# EAGLE design ioShield-A (EAGLE 6.4)
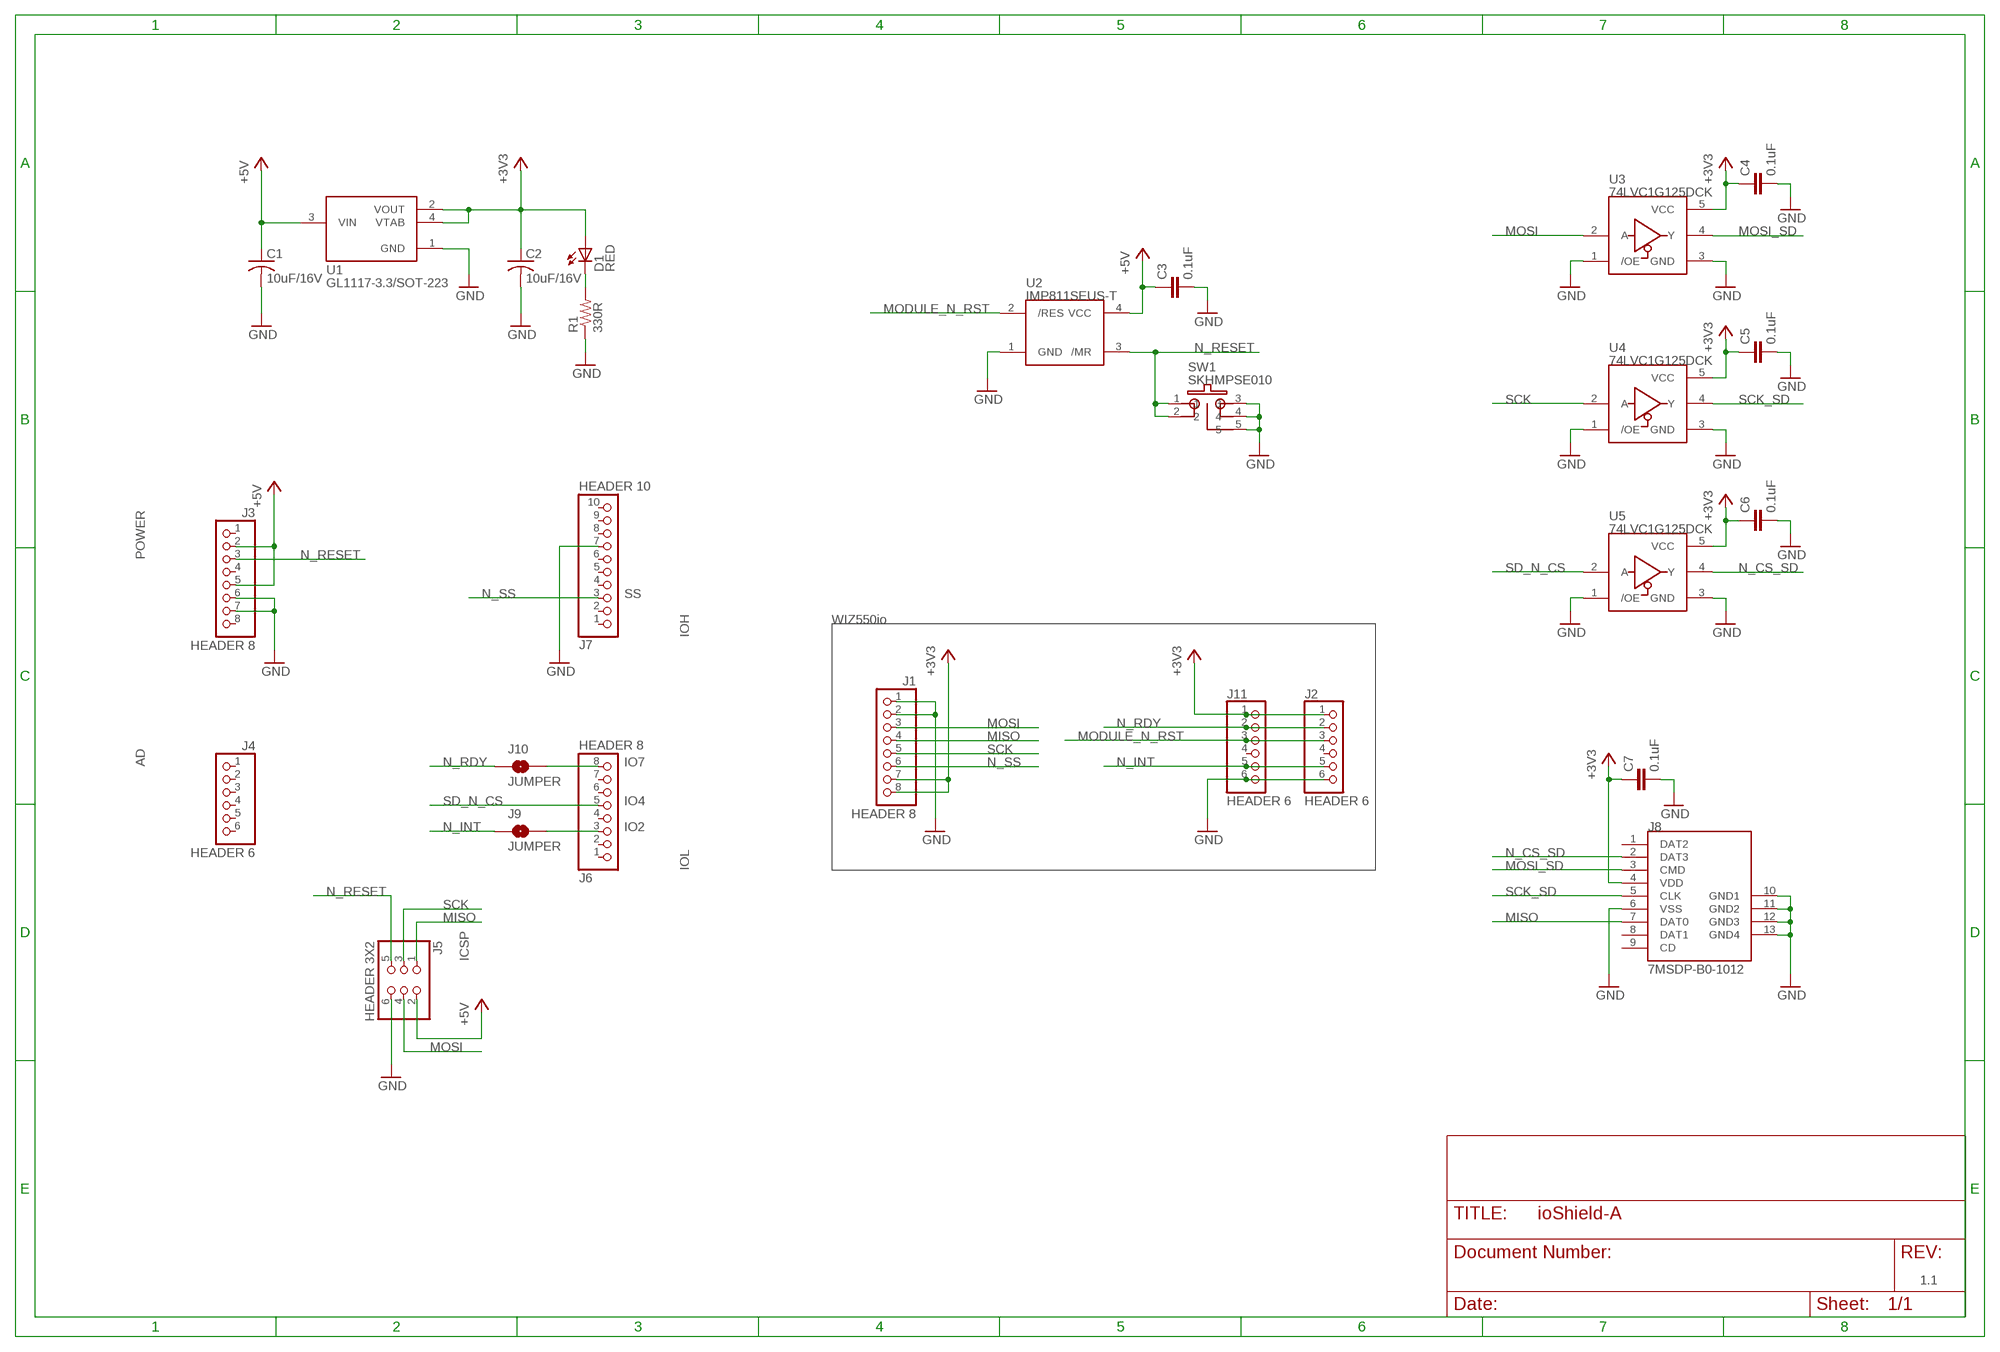
[diagram p0: schematic, sheet 1]

## Parts
C1  10uF/16V  CT-A(3216)  [CT-A(3216)]
C2  10uF/16V  CT-A(3216)  [CT-A(3216)]
C3  0.1uF  C1608  [C1608]
C4  0.1uF  C1608  [C1608]
C5  0.1uF  C1608  [C1608]
C6  0.1uF  C1608  [C1608]
C7  0.1uF  C1608  [C1608]
D1  RED  LED1608  [CHIP-LED1608]
J1  HEADER 8  HEADER8  [HEADER1X8]
J2  HEADER 6  HEADER6  [HEADER1X6]
J3  HEADER 8  HEADER8  [HEADER1X8]
J4  HEADER 6  HEADER6  [HEADER1X6]
J5  HEADER 3X2  HEADER3X2  [HEADER3X2]
J6  HEADER 8  HEADER8  [HEADER1X8]
J7  HEADER 10  HEADER10  [HEADER1X10]
J8  7MSDP-B0-1012  [MICROSD_HC]
J9  JUMPER  SJ  [SJ]
J10  JUMPER  SJ  [SJ]
J11  HEADER 6  HEADER6  [HEADER1X6]
R1  330R  R1608  [R1608]
SW1  SKHMPSE010  TACT_6.2X6.5  [TACT_6.2X6.5]
U1  GL1117-3.3/SOT-223  [SOT223_HC]
U2  IMP811SEUS-T  [SOT-143]
U3  74LVC1G125DCK  SN74LVC1G125  [SC70-5(DCK)]
U4  74LVC1G125DCK  SN74LVC1G125  [SC70-5(DCK)]
U5  74LVC1G125DCK  SN74LVC1G125  [SC70-5(DCK)]

## Nets
+3V3: C2.+ C4.1 C5.1 C6.1 C7.1 D1.A J1.7 J1.8 J2.1 J8.4(VDD) J11.1 U1.2(VOUT) U1.4(VTAB) U3.5(VCC) U4.5(VCC) U5.5(VCC)
+5V: C1.+ C3.1 J3.2 J3.5 J5.2 U1.3(VIN) U2.4(VCC)
GND: C1.- C2.- C3.2 C4.2 C5.2 C6.2 C7.2 J1.1 J1.2 J2.6 J3.6 J3.7 J5.6 J7.7 J8.6(VSS) J8.10(GND1) J8.11(GND2) J8.12(GND3) J8.13(GND4) J11.6 R1.1 SW1.3 SW1.4 SW1.5 U1.1(GND) U2.1(GND) U3.1(/OE) U3.3(GND) U4.1(/OE) U4.3(GND) U5.1(/OE) U5.3(GND)
MISO: J1.4 J5.1 J8.7(DAT0)
MODULE_N_RST: J2.3 J11.3 U2.2(/RES)
MOSI: J1.3 J5.4 U3.2(A)
MOSI_SD: J8.3(CMD) U3.4(Y)
N$1: D1.C R1.2
N$2: J6.8 J10.2
N$3: J6.3 J9.2
N_CS_SD: J8.2(DAT3) U5.4(Y)
N_INT: J2.5 J9.1 J11.5
N_RDY: J2.2 J10.1 J11.2
N_RESET: J3.3 J5.5 SW1.1 SW1.2 U2.3(/MR)
N_SS: J1.6 J7.3
SCK: J1.5 J5.3 U4.2(A)
SCK_SD: J8.5(CLK) U4.4(Y)
SD_N_CS: J6.5 U5.2(A)
Unconnected: J2.4 J3.1 J3.4 J3.8 J4.1 J4.2 J4.3 J4.4 J4.5 J4.6 J6.1 J6.2 J6.4 J6.6 J6.7 J7.1 J7.2 J7.4 J7.5 J7.6 J7.8 J7.9 J7.10 J8.1(DAT2) J8.8(DAT1) J8.9(CD) J11.4

## Notes on the sheet
- POWER
- SS
- WIZ550io
- IOH
- AD | IO7
- IO4
- IO2
- IOL
- ICSP
- 1.1

## Library data of the parts
C1 C2 = rlc_HC:CT-A(3216): CT-A(3216) Tantal Capacitor A-Size
C3-C7 = rlc_HC:C1608: C1608
D1 = rlc_HC:LED1608: LED 1608
J1 J3 J6 = pinheader_HC:HEADER8: HEADER 1X8 2.54mm
J2 J4 J11 = pinheader_HC:HEADER6: HEADER 1X6 2.54mm
J5 = pinheader_HC:HEADER3X2: HEADER 3X2 2.54mm
J7 = pinheader_HC:HEADER10: HEADER 1X10 2.54mm
J8 = socket_HC:7MSDP-B0-1012: Micro SD Connector Part No. 7MSDP-B0-1012
J9 J10 = jumper_HC:SJ: Jumper-pad
R1 = rlc_HC:R1608: R1608
SW1 = switch_HC:TACT_6.2X6.5: ALPS TACT_6.2X6.5
U1 = dc-dc:GL1117-3.3/SOT-223: GL1117-3.3/SOT-223
U2 = jjam_HC:IMP811SEUS-T: IMP811SEUS-T SOT-143
U3-U5 = jjam_HC:SN74LVC1G125: SN74LVC1G125 DCK(SC70)

## Board
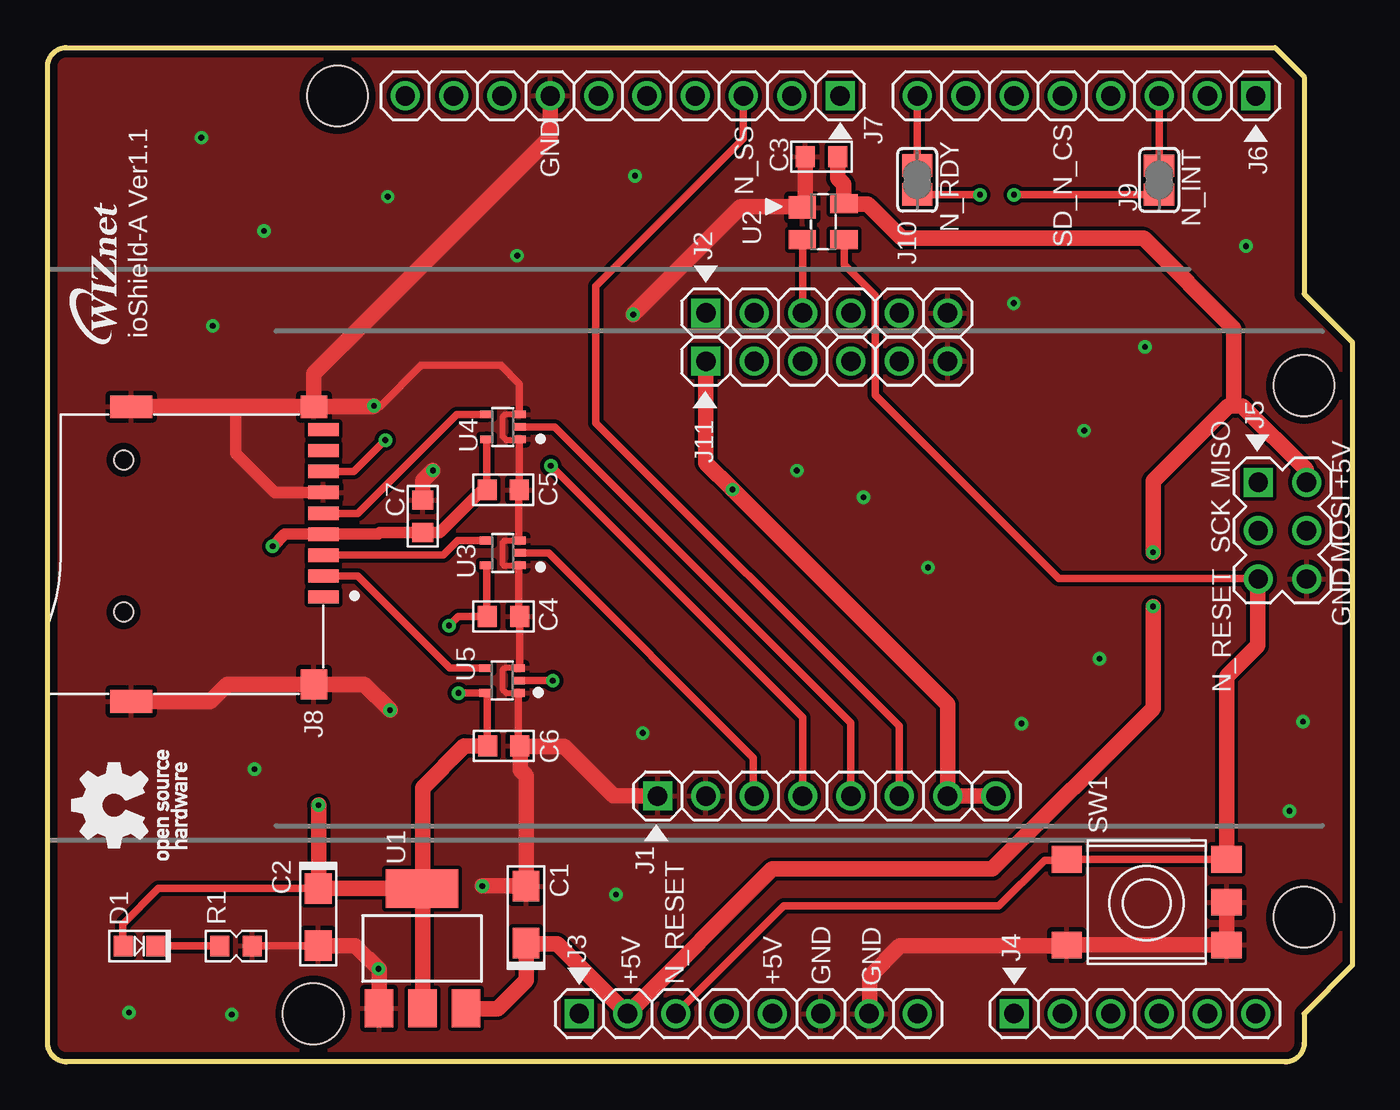
[diagram p1: board, top side]
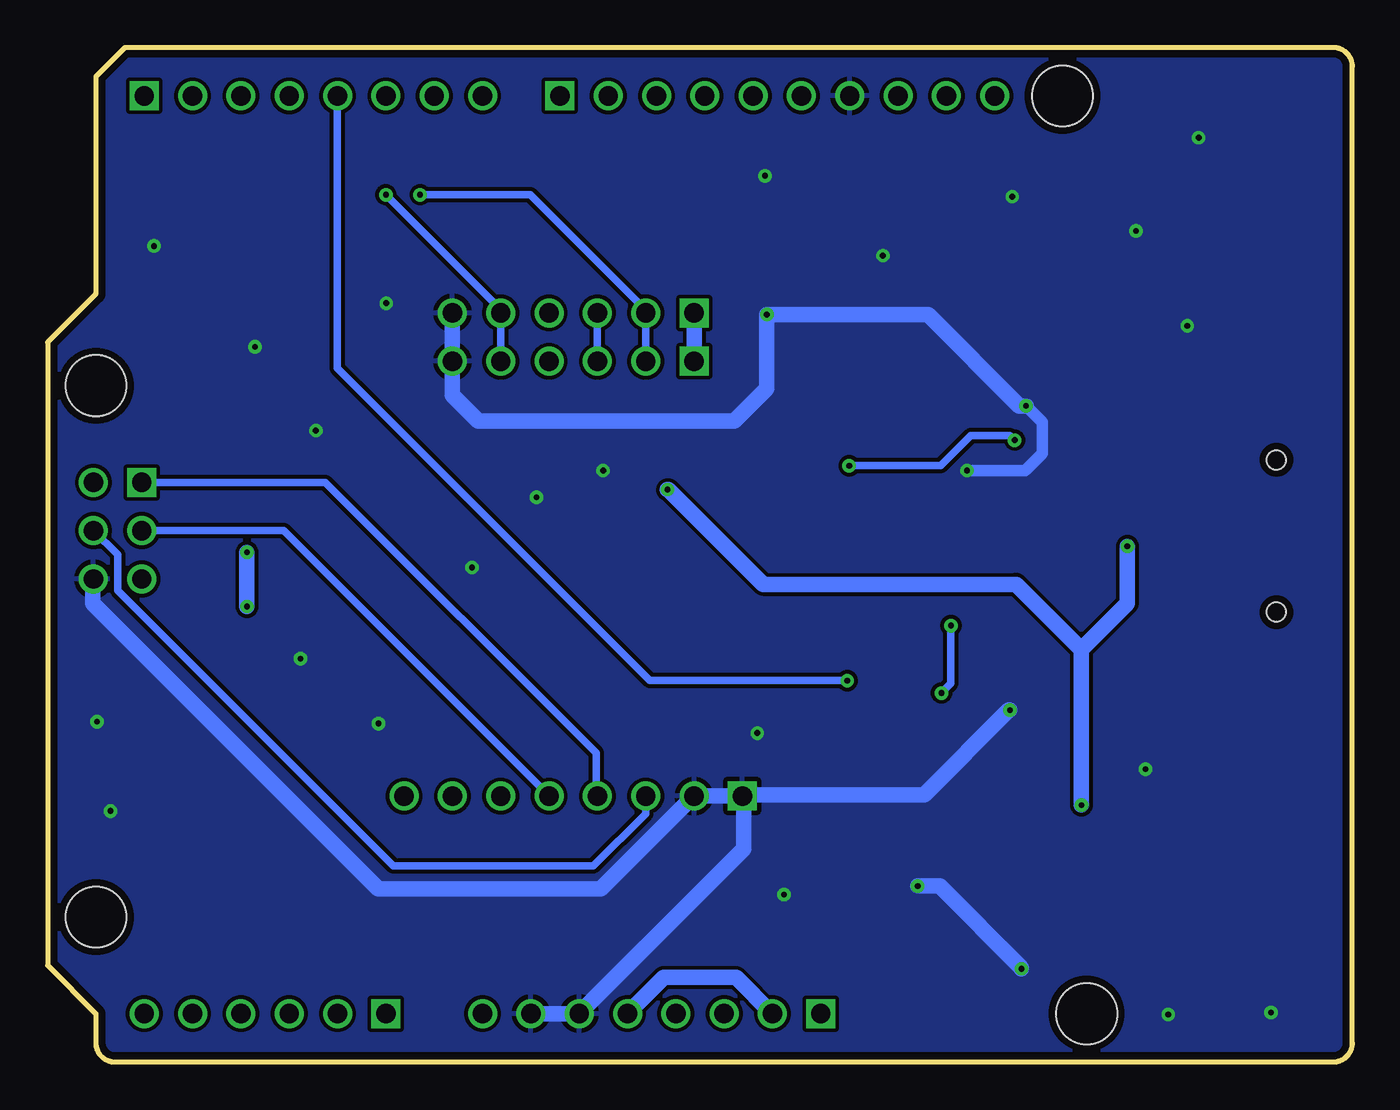
[diagram p2: board, bottom side, seen from below]

Size 68.58 x 53.34 mm. Coordinates in mm from the lower left corner, seen from the top.
Outline: 64.52,53.34 66.04,51.82 66.04,40.39 68.58,37.85 68.58,5.08 66.04,2.54 66.04,1 arc-90 65.04,0 1,0 arc-90 0,1 0,52.34 arc-90 1,53.34 64.52,53.34
Copper layers (1*16): Top 0.035mm / dielectric 1.5mm / Bottom 0.035mm
Design rules "default *": minimum track width 10mil, minimum drill 11mil, track to track 8mil, track to pad 8mil, pad to pad 8mil, via to via 8mil, smd to smd 8mil, copper to edge 15mil, drill to drill 8mil, minimum pad ring 10mil, minimum via ring 8mil, stop-mask expansion 4mil, vias tented up to drill 0mil, thermal gap 10mil
Holes 3.2 mm at 15.24,50.8 13.97,2.54 66.04,35.56 66.04,7.62

### Footprints (pad centres in the part's own frame; a part is rotated, then mirrored left to right if it is on the bottom)
CT-A(3216) = smd 1.6 x 1.4: + -1.5,0; - 1.5,0
C1608 = smd 1 x 1.1: 1 -0.85,0; 2 0.85,0
CHIP-LED1608 = smd 1 x 1.1: A -0.85,0; C 0.85,0
HEADER1X8 = drill 1.016 square: 1 -8.89,0 | drill 1.016: 2 -6.35,0; 3 -3.81,0; 4 -1.27,0; 5 1.27,0; 6 3.81,0; 7 6.35,0; 8 8.89,0
HEADER1X6 = drill 1.016 square: 1 -6.35,0 | drill 1.016: 2 -3.81,0; 3 -1.27,0; 4 1.27,0; 5 3.81,0; 6 6.35,0
HEADER3X2 = drill 1.016 square: 1 0,0 | drill 1.016: 2 0,-2.54; 3 -2.54,0; 4 -2.54,-2.54; 5 -5.08,0; 6 -5.08,-2.54
HEADER1X10 = drill 1.016 square: 1 -11.43,0 | drill 1.016: 2 -8.89,0; 3 -6.35,0; 4 -3.81,0; 5 -1.27,0; 6 1.27,0; 7 3.81,0; 8 6.35,0; 9 8.89,0; 10 11.43,0
MICROSD_HC = smd 0.7 x 1.6: 1 10.6,11.2; 2 9.5,11.2; 3 8.4,11.2; 4 7.3,11.2; 5 6.2,11.2; 6 5.1,11.2; 7 4,11.2; 8 2.9,11.2; 9 1.8,11.2 | smd 1.2 x 1.4: 10 0.6,10.7 | smd 1.6 x 1.4: 11 15.2,10.7 | smd 1.2 x 2.2: 12 16.1,1.1; 13 0.6,1.1 | hole 1: 3.4,0.7; 11.4,0.7
SJ = smd 1.168 x 1.6: 1 -0.762,0; 2 0.762,0
R1608 = smd 1 x 1.1: 1 -0.85,0; 2 0.85,0
TACT_6.2X6.5 = smd 1.6 x 1.4: 1 -4.2,0; 2 4.2,0; 3 -4.2,-4.5; 4 4.2,-4.5; 5 4.2,-2.25
SOT223_HC = smd 1.499 x 2.007: 1 -2.261,-3.15; 2 0.025,-3.15; 3 2.311,-3.15 | smd 3.81 x 2.007: 4 0,3.15
SOT-143 = smd 1.2 x 1.44: 1 -0.75,-1.1 | smd 1 x 1.44: 2 0.95,-1.1; 3 0.95,1.1; 4 -0.95,1.1
SC70-5(DCK) = smd 0.4 x 0.7: 1 -0.65,-0.85; 2 0,-0.85; 3 0.65,-0.85; 4 0.65,0.85; 5 -0.65,0.85

### Placement (x,y rotation side)
C1  25.15,7.75 90 top
C2  14.22,7.62 270 top
C3  40.68,47.6 180 top
C4  23.96,23.43 0 top
C5  23.95,30.09 0 top
C6  23.98,16.62 0 top
C7  19.72,28.7 90 top
D1  4.83,6.1 0 top
E$1  [OSH800_DOT-DCALE-0.3MIL]  3.5,13.5 90 top
J1  40.95,13.98 0 top
J2  40.95,39.38 0 top
J3  36.83,2.54 0 top
J4  57.15,2.54 0 top
J5  63.63,30.48 90 top
J6  54.61,50.8 180 top
J7  30.23,50.8 180 top
J8  3.3,35.05 270 top
J9  58.42,46.37 90 top
J10  45.71,46.38 90 top
J11  40.95,36.84 0 top
R1  9.91,6.1 180 top
SW1  57.76,10.65 0 top
U1  19.68,5.97 0 top
U2  40.76,44.18 270 top
U3  23.92,26.77 90 top
U4  23.93,33.4 90 top
U5  23.89,20.06 90 top
U$1  [WIZNET_DOT-SCALE-0.1MIL]  3,41.5 90 top

### Tracks (layer width: path | path; a pad name or v marks a point on that pad's centre or on a via)
+3V3  (via drill 0.3)
  Top 0.406: C2.+ 5.82,9.12 3.95,7.25 3.95,6.12 D1.A | U4.5 23.08,30.1 C5.1 | U3.5 23.07,23.47 C4.1 21.58,23.43 v21.1,22.95 | v21.6,19.4 U5.5 23.1,19.35 23.1,16.65
  Top 0.61: 19.62,27.75 C7.1 | C7.1 20.6,27.85 22.84,30.09 C5.1 | v11.83,27.11 12.47,27.75 J8.4 17.37,27.75 17.47,27.85 C7.1
  Top 0.813: U1.2 19.71,9.09 | 19.71,9.09 U1.4 C2.+ 14.24,9.14 v14.24,13.51 | 23.1,16.65 C6.1 21.91,16.62 19.71,14.42 19.71,9.09 | J1.8 J1.7 47.3,18.8 v36,30.1 34.6,31.5 J11.1
  Bottom 0.406: v21.1,22.95 21.1,19.9 v21.6,19.4
  Bottom 0.813: J2.1 J11.1 | 14.25,21.7 17.67,25.12 30.97,25.12 35.95,30.1 v36,30.1 | 14.25,21.7 v14.25,13.52 v14.24,13.51 | v11.83,27.11 11.83,24.12 14.25,21.7
+5V  (via drill 0.3)
  Top 0.813: C1.+ | C1.+ 25.15,4.3 23.65,2.8 22.02,2.8 U1.3 | C3.1 41.53,46.47 41.85,46.15 41.85,45.15 U2.4 | J5.2 66.15,30.5 66.15,31.15 62.8,34.5 62.4,34.5 | C1.+ 25.19,6.2 26.8,6.2 30.46,2.54 J3.2 38.09,10.15 49.65,10.15 58.1,18.6 v58.1,23.95 | 62.4,34.5 62.05,34.5 58.1,30.55 v58.1,26.8 | 62.4,34.5 62.35,34.55 62.35,38.56 57.6,43.31 44.89,43.31 43.1,45.1 41.9,45.1 U2.4 | U2.4
  Bottom 0.813: v58.1,26.8 v58.1,23.95 | J3.5 36.2,4.45 32.39,4.45 J3.2
GND  (via drill 0.3)
  Top 0.305: U4.3 24.05,34.05 23.9,33.9 23.9,32.9 24.1,32.7 24.74,32.7 U4.1 | 24.75,27.4 24,27.4 23.9,27.3 23.9,26.2 24,26.1 24.75,26.1 U3.1 | U5.3 24.01,20.71 23.9,20.6 23.9,19.6 24.1,19.4 U5.1
  Top 0.406: R1.1 14.2,6.1 C2.- | U3.1 24.77,23.47 C4.2 24.81,20.78 U5.3 | U5.1 24.74,16.71 C6.2 | U4.1 24.8,32.73 C5.2 24.77,30.06 U3.3 24.75,27.4 | U4.3 24.8,34.06 24.8,35.65 23.81,36.64 19.64,36.64 17.5,34.5 v17.15,34.5
  Top 0.61: J8.6 11.95,29.95 9.9,32 9.9,34.45
  Top 0.813: U1.1 17.42,4.88 v17.4,4.9 16.18,6.12 C2.- | v22.85,9.25 C1.- 25.15,15.05 24.85,15.35 24.85,16.6 | J3.7 43.2,2.56 43.2,4.5 44.8,6.1 53.51,6.1 SW1.3 SW1.4 SW1.5 | 39.65,44.95 U2.1 | C3.2 39.83,45.1 U2.1 | J1.1 29.77,13.98 27.15,16.6 24.85,16.6 | 24.85,16.6 C6.2 | C7.2 19.72,30.57 v20.25,31.1 | J8.12 8.55,18.95 9.45,19.85 J8.11 16.65,19.85 v18,18.5 | J8.10 17.1,34.45 v17.15,34.5 | v30.78,39.3 30.78,39.32 36.44,44.98 39.62,44.98 U2.1 | J8.13 9.9,34.45 J8.10 | J7.7 26.42,48.62 14,36.2 J8.10
  Bottom 0.61: v20.25,31.1 17.2,31.1 16.3,32 16.3,33.65 v17.15,34.5
  Bottom 0.813: v17.4,4.9 17.4,4.95 21.7,9.25 v22.85,9.25 | J1.1 J1.2 34.62,13.98 39.5,9.1 51.2,9.1 66.2,24.1 66.2,25.37 J5.6 | v18,18.5 18.05,18.5 22.5,14.05 32,14.05 J1.1 | v17.15,34.5 17.5,34.5 22.3,39.3 v30.78,39.3 30.78,35.42 32.5,33.7 45.94,33.7 47.3,35.06 J11.6 J2.6 | J1.1 32,13.92 32,11.2 40.64,2.56 J3.6 J3.7
  other vias: 17.88,45.5 8.08,48.6 24.68,42.4 30.88,46.6 11.38,43.7 10.88,15.4 4.28,2.6 9.68,2.5 8.68,38.7 39.38,31.1 42.88,29.7 46.28,26 54.48,33.2 57.68,37.6 50.78,39.9 55.28,21.2 51.18,17.8 31.28,17.3 29.88,8.8 65.98,17.9 65.28,13.2 62.98,42.9
  pour Top: 1.02,0 arc-90 0,1.02 0,52.32 arc-90 1.02,53.34 64.52,53.34 66.04,51.82 66.04,40.39 68.58,37.85 68.58,5.08 66.04,2.54 66.04,1.02 arc-90 65.02,0
  pour Bottom: 1.02,0 arc-90 0,1.02 0,52.32 arc-90 1.02,53.34 64.52,53.34 66.04,51.82 66.04,40.39 68.58,37.85 68.58,5.08 66.04,2.54 66.04,1.02 arc-90 65.02,0
MISO  (via drill 0.3)
  Top 0.406: J1.4 39.68,18.12 v26.45,31.35 | 14.55,31 J8.7 16.1,31.05 v17.75,32.7
  Bottom 0.406: J5.1 53.98,30.48 39.75,16.26 39.75,14.05 J1.4 | v26.45,31.35 21.65,31.35 20.05,32.95 18,32.95 v17.75,32.7
MODULE_N_RST
  Top 0.406: J2.3 39.68,43.22 U2.2
  Bottom 0.406: J2.3 J11.3
MOSI
  Top 0.406: U3.2 26.33,26.77 37.1,16 37.1,14.03 J1.3
  Bottom 0.406: J1.3 37.14,13.06 39.9,10.3 50.4,10.3 64.9,24.8 64.9,26.67 J5.4
MOSI_SD
  Top 0.406: U3.4 21.57,27.42 20.8,26.65 J8.3
N$1
  Top 0.406: D1.C R1.2
N$2
  Top 0.406: J6.8 J10.2
N$3
  Top 0.406: J6.3 J9.2
N_CS_SD
  Top 0.406: U5.4 21.14,20.71 16.3,25.55 J8.2
N_INT  (via drill 0.3)
  Top 0.406: v50.8,45.6 J9.1
  Bottom 0.406: J11.5 J2.5 44.76,39.56 v50.8,45.6
N_RDY  (via drill 0.3)
  Top 0.406: v49,45.6 45.73,45.6 J10.1
  Bottom 0.406: J11.2 J2.2 37.14,39.54 43.2,45.6 v49,45.6
N_RESET
  Top 0.406: 33.05,2.57 J3.3 38.68,8.2 50,8.2 52.4,10.6 53.51,10.6 SW1.1 SW1.2 | U2.3 41.86,41.94 43.5,40.3 43.5,35.07 53.15,25.42 63.61,25.42 J5.5
  Top 0.813: SW1.2 61.96,20.26 63.6,21.9 63.6,25.37 J5.5
N_SS
  Top 0.406: 44.75,14 J1.6 44.76,17.66 28.82,33.6 28.82,40.79 36.58,48.55 J7.3
SCK
  Top 0.406: 42.2,14.01 J1.5 42.22,17.15 42.22,17.52 42.22,17.83 26.66,33.39 U4.2
  Bottom 0.406: J5.3 56.18,27.94 J1.5
SCK_SD
  Top 0.406: U4.4 21.5,34.05 16.3,28.85 J8.5
SD_N_CS  (via drill 0.3)
  Top 0.406: v26.55,20.05 U5.2
  Bottom 0.406: v26.55,20.05 36.92,20.05 53.36,36.49 53.36,50.78 J6.5

### Text on the board
tPlace: GND | N_SS | N_RDY | N_INT | SD_N_CS | ioShield-A Ver1.1 | MISO | +5V | SCK | MOSI | GND | N_RESET | +5V | N_RESET | +5V | GND | GND